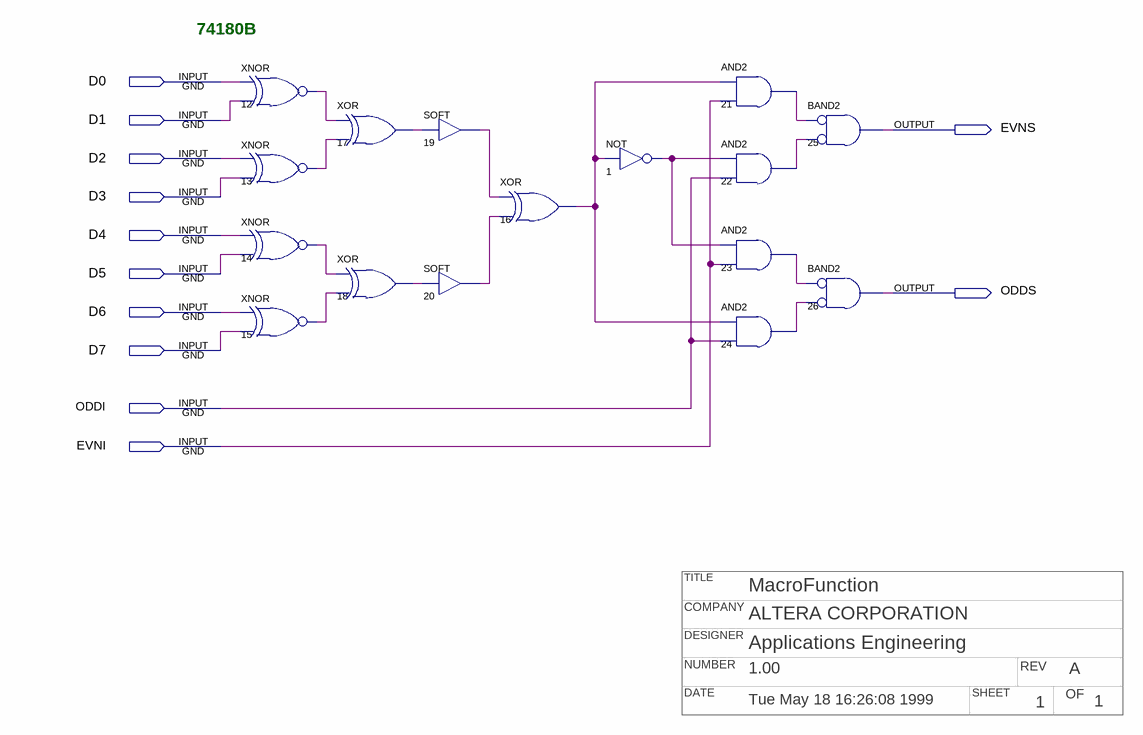
[diagram p0: schematic sheet]
// Quartus schematic 74180b.bdf as structural Verilog: 16 symbols, 12 pins
// Title block: TITLE: MacroFunction; COMPANY: ALTERA CORPORATION; DESIGNER: Applications Engineering; NUMBER: 1.00; REV: A; DATE: Tue May 18 16:26:08 1999; SHEET: 1; OF: 1
module \74180b  (
  input  D0,
  input  D1,
  input  D2,
  input  D3,
  input  D4,
  input  D5,
  input  D6,
  input  D7,
  input  ODDI,
  input  EVNI,
  output EVNS,
  output ODDS
);

  wire n1_out, n12_out, n13_out, n14_out, n15_out, n16_out, n17_out, n18_out, n19_out, n20_out, n21_out,
       n22_out, n23_out, n24_out;

  xnor u_12 (n12_out, D0, D1);
  xnor u_13 (n13_out, D2, D3);
  xnor u_14 (n14_out, D4, D5);
  xnor u_15 (n15_out, D6, D7);
  xor u_17 (n17_out, n12_out, n13_out);
  xor u_18 (n18_out, n14_out, n15_out);
  SOFT u_19 (.IN(n17_out), .OUT(n19_out));
  SOFT u_20 (.IN(n18_out), .OUT(n20_out));
  xor u_16 (n16_out, n19_out, n20_out);
  not u_1 (n1_out, n16_out);
  and u_21 (n21_out, n16_out, EVNI);
  and u_22 (n22_out, n1_out, ODDI);
  and u_23 (n23_out, n1_out, EVNI);
  and u_24 (n24_out, n16_out, ODDI);
  and u_25 (EVNS, ~n21_out, ~n22_out);  // BAND2
  and u_26 (ODDS, ~n23_out, ~n24_out);  // BAND2

  // Notes on the sheet:
  //   74180B
endmodule
